# EAGLE design A4980 (EAGLE 6.5.0)
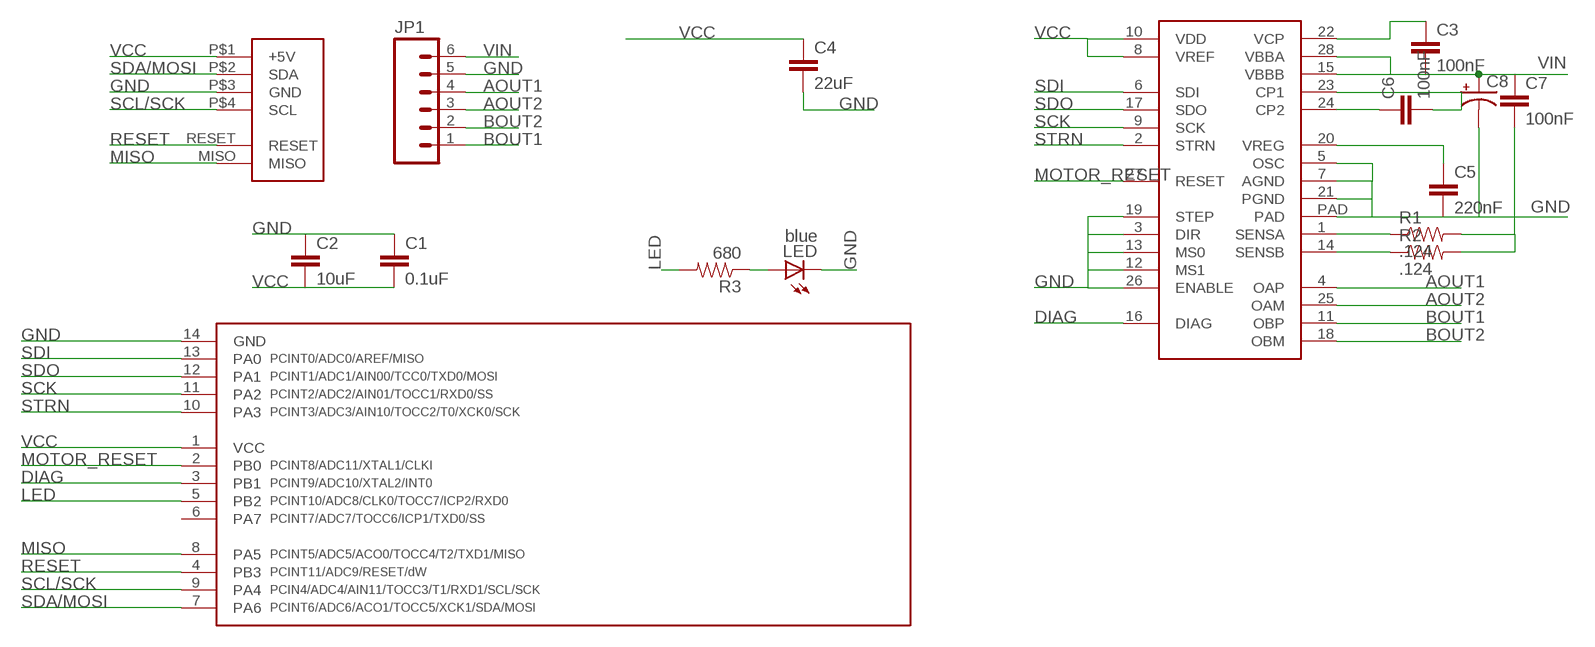
[diagram p0: schematic, sheet 1]

## Parts
C1  0.1uF  CAP0805  [0805]
C2  10uF  CAP0805  [0805]
C3  100nF  CAP0805  [0805]
C4  22uF  22UF-6.3V-20%(0805)  [0805]
C5  220nF  CAP0805  [0805]
C6  100nF  CAP0805  [0805]
C7  100nF  CAP0805  [0805]
C8  CAP_POLD  [PANASONIC_D]
JP1  M06SIP  [1X06]
LED  blue  LEDCHIPLED_1206  [CHIPLED_1206]
R1  .124  RESISTOR0805-RES  [0805]
R2  .124  RESISTOR0805-RES  [0805]
R3  680  RESISTOR0805-RES  [0805]
U$1  A4980  [TSSOP-28]
U$3  TINY841  [SOIC14]
U$4  FOOTPRINT  [FOOTPRINT]

## Nets
AOUT1: JP1.4 U$1.4(OAP)
AOUT2: JP1.3 U$1.25(OAM)
BOUT1: JP1.1 U$1.11(OBP)
BOUT2: JP1.2 U$1.18(OBM)
DIAG: U$1.16(DIAG) U$3.3(PB1)
GND: C1.1 C2.1 C4.2 C5.2 C7.2 C8.- JP1.5 LED.C R1.2 R2.2 U$1.3(DIR) U$1.5(OSC) U$1.7(AGND) U$1.12(MS1) U$1.13(MS0) U$1.19(STEP) U$1.21(PGND) U$1.26(ENABLE) U$1.PAD U$3.14(GND) U$4.P$3(GND)
LED: R3.2 U$3.5(PB2)
MISO: U$3.8(PA5) U$4.MISO
MOTOR_RESET: U$1.27(RESET) U$3.2(PB0)
N$2: C3.1 U$1.22(VCP)
N$3: R1.1 U$1.1(SENSA)
N$4: R2.1 U$1.14(SENSB)
N$5: LED.A R3.1
N$6: C5.1 U$1.20(VREG)
N$7: C6.1 U$1.24(CP2)
N$8: C6.2 U$1.23(CP1)
RESET: U$3.4(PB3) U$4.RESET
SCK: U$1.9(SCK) U$3.11(PA2)
SCL/SCK: U$3.9(PA4) U$4.P$4(SCL)
SDA/MOSI: U$3.7(PA6) U$4.P$2(SDA)
SDI: U$1.6(SDI) U$3.13(PA0)
SDO: U$1.17(SDO) U$3.12(PA1)
STRN: U$1.2(STRN) U$3.10(PA3)
VCC: C1.2 C2.2 C4.1 U$1.8(VREF) U$1.10(VDD) U$3.1(VCC) U$4.P$1(+5V)
VIN: C3.2 C7.1 C8.+ JP1.6 U$1.15(VBBB) U$1.28(VBBA)
Unconnected: U$3.6(PA7)

## Library data of the parts
C1-C3 C5-C7 = SparkFun-Capacitors:CAP: Capacitor Standard 0603 ceramic capacitor, and 0.1" leaded capacitor.
C4 = SparkFun-Capacitors:22UF-6.3V-20%(0805): CAP-08402 Ceramic; PROD_ID: CAP-08402
C8 = SparkFun-Capacitors:CAP_POL: Capacitor Polarized These are standard SMD and PTH capacitors. Normally 10uF, 47uF, and 100uF in electrolytic and tantalum varieties. Always verify the external diameter of the through hole cap, it varies with capacity, voltage, and manufacturer. The EIA devices should be standard.
JP1 = SparkFun-Connectors:M06: Header 6 Standard 6-pin 0.1" header. Use with straight break away headers (SKU : PRT-00116), right angle break away headers (PRT-00553), swiss pins (PRT-00743), machine pins (PRT-00117), and female headers (PRT-00115). Molex polarized connector foot print use with SKU : PRT-08094 with associated crimp pins and housings. NOTES ON THE VARIANTS LOCK and LOCK_LONGPADS... This footprint was designed to help hold the alignment of a through-hole component (i.e. 6-pin header) while soldering it into place. You may notice that each hole has been shifted either up or down by 0.005 of an inch from it's more standard position (which is a perfectly straight line). This slight alteration caused the pins (the squares in the middle) to touch the edges of the holes. Because they are alternating, it causes a "brace" to hold the component in place. 0.005 has proven to be the perfect amount of "off-center" position when using our standard breakaway headers. Although looks a little odd when you look at the bare footprint, once you have a header in there, the alteration is very hard to notice. Also,if you push a header all the way into place, it is covered up entirely on the bottom side. This idea of altering the position of holes to aid alignment will be further integrated into the Sparkfun Library for other footprints. It can help hold any component with 3 or more connection pins.
LED = led:LED: LED OSRAM: - CHIPLED LG R971, LG N971, LY N971, LG Q971, LY Q971, LO R971, LY R971 LH N974, LH R974 LS Q976, LO Q976, LY Q976 LO Q996 - Hyper CHIPLED LW Q18S LB Q993, LB Q99A, LB R99A - SideLED LS A670, LO A670, LY A670, LG A670, LP A670 LB A673, LV A673, LT A673, LW A673 LH A674 LY A675 LS A676, LA A676, LO A676, LY A676, LW A676 LS A679, LY A679, LG A679 - Hyper Micro SIDELED® LS Y876, LA Y876, LO Y876, LY Y876 LT Y87S - SmartLED LW L88C, LW L88S LB L89C, LB L89S, LG L890 LS L89K, LO L89K, LY L89K LS L896, LA L896, LO L896, LY L896 - TOPLED LS T670, LO T670, LY T670, LG T670, LP T670 LSG T670, LSP T670, LSY T670, LOP T670, LYG T670 LG T671, LOG T671, LSG T671 LB T673, LV T673, LT T673, LW T673 LH T674 LS T676, LA T676, LO T676, LY T676, LB T676, LH T676, LSB T676, LW T676 LB T67C, LV T67C, LT T67C, LS T67K, LO T67K, LY T67K, LW E67C LS E67B, LA E67B, LO E67B, LY E67B, LB E67C, LV E67C, LT E67C LW T67C LS T679, LY T679, LG T679 LS T770, LO T770, LY T770, LG T770, LP T770 LB T773, LV T773, LT T773, LW T773 LH T774 LS E675, LA E675, LY E675, LS T675 LS T776, LA T776, LO T776, LY T776, LB T776 LHGB T686 LT T68C, LB T68C - Hyper Mini TOPLED® LB M676 - Mini TOPLED Santana® LG M470 LS M47K, LO M47K, LY M47K Source: http://www.osram.convergy.de LUXEON: - LUMILED® LXK2-PW12-R00, LXK2-PW12-S00, LXK2-PW14-U00, LXK2-PW14-V00 LXK2-PM12-R00, LXK2-PM12-S00, LXK2-PM14-U00 LXK2-PE12-Q00, LXK2-PE12-R00, LXK2-PE12-S00, LXK2-PE14-T00, LXK2-PE14-U00 LXK2-PB12-K00, LXK2-PB12-L00, LXK2-PB12-M00, LXK2-PB14-N00, LXK2-PB14-P00, LXK2-PB14-Q00 LXK2-PR12-L00, LXK2-PR12-M00, LXK2-PR14-Q00, LXK2-PR14-R00 LXK2-PD12-Q00, LXK2-PD12-R00, LXK2-PD12-S00 LXK2-PH12-R00, LXK2-PH12-S00 LXK2-PL12-P00, LXK2-PL12-Q00, LXK2-PL12-R00 Source: www.luxeon.com KINGBRIGHT: KA-3528ASYC Source: www.kingbright.com
R1 R2 = SparkFun-Resistors:RESISTOR: Resistor Basic schematic elements and footprints for 0603, 1206, and PTH resistors.
R3 = SparkFun-Passives:RESISTOR: Resistor Basic schematic elements and footprints for 0603, 1206, and PTH resistors.
U$1 = IntegerLabs:A4980
U$3 = IntegerLabs:TINY841
U$4 = IntegerLabs:FOOTPRINT

## Board
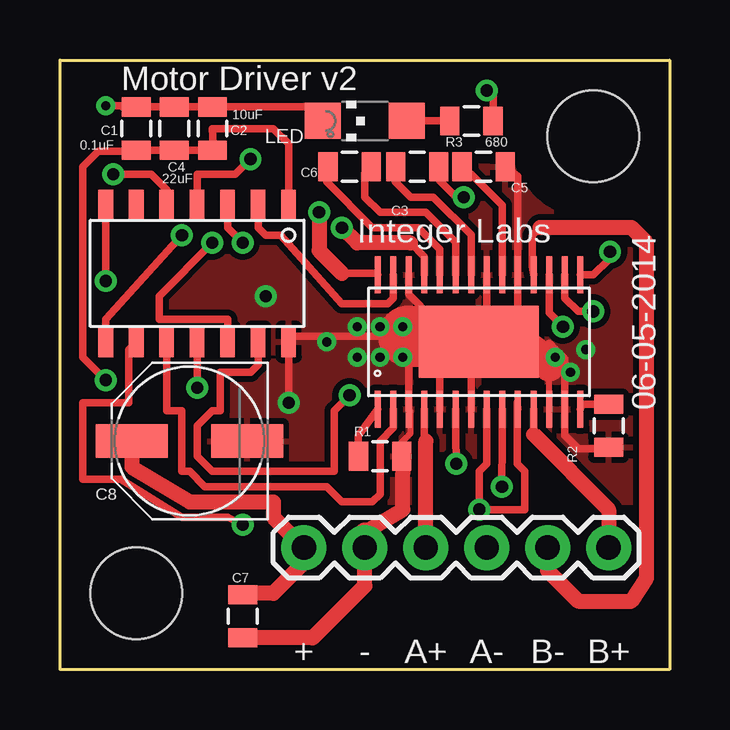
[diagram p1: board, top side]
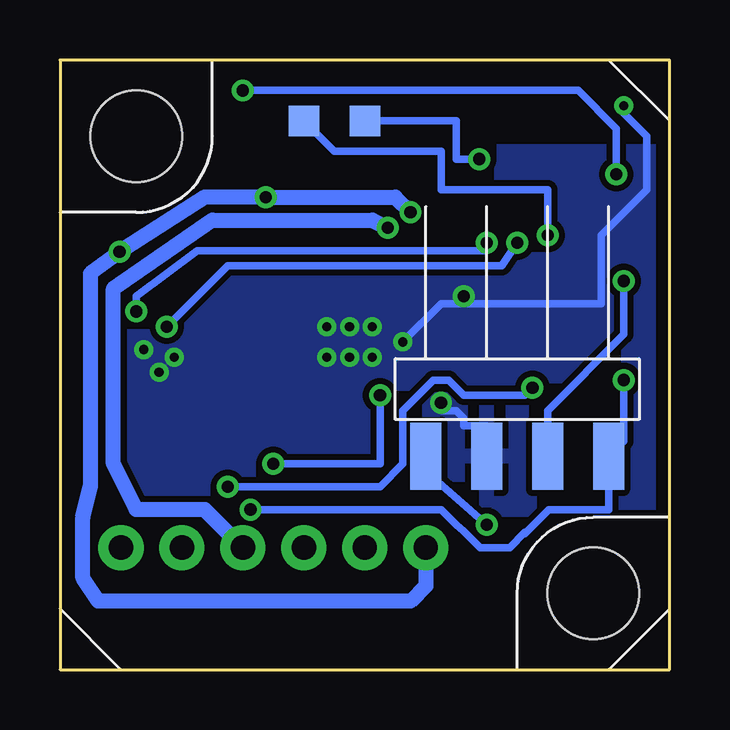
[diagram p2: board, bottom side, seen from below]

Size 25.4 x 25.4 mm. Coordinates in mm from the lower left corner, seen from the top.
Copper layers (1*16): Top 0.0178mm / dielectric 59mil / Bottom 0.0178mm
Design rules "SSC-EAGLE-2Lyr_v1.0.0.3": minimum track width 6mil, minimum drill 14mil, track to track 6mil, track to pad 6mil, pad to pad 6mil, via to via 6mil, smd to smd 6mil, copper to edge 20mil, drill to drill 16mil, minimum pad ring 8mil, minimum via ring 8mil, stop-mask expansion 3mil, vias tented up to drill 0mil, thermal gap 10mil

### Footprints (pad centres in the part's own frame; a part is rotated, then mirrored left to right if it is on the bottom)
0805 = smd 0.8 x 1.2: 1 -0.9,0; 2 0.9,0
PANASONIC_D = smd 3 x 1.4: + 2.4,0; - -2.4,0
1X06 = drill 1.016 pad 1.88: 1 0,0; 2 2.54,0; 3 5.08,0; 4 7.62,0; 5 10.16,0; 6 12.7,0
CHIPLED_1206 = smd 1.5 x 1.5: A 0,-1.75; C 0,1.75
TSSOP-28 = smd 0.25 x 1.55: 1 -4.55,-2.8; 2 -3.9,-2.8; 3 -3.25,-2.8; 4 -2.6,-2.8; 5 -1.95,-2.8; 6 -1.3,-2.8; 7 -0.65,-2.8; 8 0,-2.8; 9 0.65,-2.8; 10 1.3,-2.8; 11 1.95,-2.8; 12 2.6,-2.8; 13 3.25,-2.8; 14 3.9,-2.8; 15 3.9,2.8; 16 3.25,2.8; 17 2.6,2.8; 18 1.95,2.8; 19 1.3,2.8; 20 0.65,2.8; 21 0,2.8; 22 -0.65,2.8; 23 -1.3,2.8; 24 -1.95,2.8; 25 -2.6,2.8; 26 -3.25,2.8; 27 -3.9,2.8; 28 -4.55,2.8 | smd 5 x 3: PAD -0.325,0
SOIC14 = smd 0.61 x 1.27: 1 0,-3.175; 2 1.27,-3.175; 3 2.54,-3.175; 4 3.81,-3.175; 5 5.08,-3.175; 6 6.35,-3.175; 7 7.62,-3.175; 8 7.62,2.54; 9 6.35,2.54; 10 5.08,2.54; 11 3.81,2.54; 12 2.54,2.54; 13 1.27,2.54; 14 0,2.54
FOOTPRINT = smd 1.27 x 1.27 bottom: MISO 15.24,22.86; RESET 12.7,22.86 | smd 1.295 x 2.794 bottom: P$1 2.54,8.89; P$2 5.08,8.89; P$3 7.62,8.89; P$4 10.16,8.89 | hole 3.81: 22.225,22.225; 3.175,3.175

### Placement (x,y rotation side)
C1  3.17,22.54 270 top
C2  6.35,22.54 270 top
C3  14.88,20.95 0 top
C4  4.76,22.54 90 top
C5  17.65,20.95 0 top
C6  12.06,20.95 0 top
C7  7.62,2.22 270 top
C8  5.4,9.53 180 top
JP1  22.86,5.08 180 top
LED  12.7,22.86 90 top
R1  13.34,8.89 0 top
R2  22.86,10.16 270 top
R3  17.14,22.86 0 top
U$1  17.78,13.65 0 top
U$3  9.53,16.19 180 top
U$4  0,0 0 top

### Tracks (layer width: path | path; a pad name or v marks a point on that pad's centre or on a via)
AOUT1
  Top 0.305: 15.24,9.53 15.18,9.59 U$1.4
  Top 0.635: JP1.4 15.24,9.53
AOUT2  (via drill 0.51)
  Top 0.305: U$1.25 15.18,17.2 14.61,17.78
  Top 0.635: 14.61,17.78 12.38,17.78 v11.75,18.41
  Bottom 0.635: JP1.3 19.37,6.67 22.23,6.67 23.18,8.57 23.18,15.88 19.05,18.73 12.38,18.73 v11.75,18.41
BOUT1
  Top 0.305: U$1.11 19.73,9.8
  Top 0.635: 19.73,9.8 22.86,6.67 JP1.1
BOUT2
  Top 0.305: 20,18.41 19.68,18.1 19.68,16.82 U$1.18
  Top 0.635: JP1.2 20.32,4.13 21.59,2.86 23.81,2.86 24.45,3.81 24.45,17.78 23.81,18.41 20,18.41
DIAG  (via drill 0.51)
  Top 0.305: U$1.16 21.03,15.48 21.59,14.92 v22.23,14.92 | U$3.3 6.99,18.41 v7.62,17.78
  Bottom 0.305: v7.62,17.78 7.62,17.46 19.68,17.46 22.23,15.56 v22.23,14.92
GND  (via drill 0.38, 0.51)
  Top 0.254: U$1.12 20.38,12.64 | 19.68,13.34 20.12,13.34 20.38,13.59 | R1.2 14.23,9.47 14.61,9.84 14.61,10.78 U$1.3
  Top 0.305: U$1.3 14.53,13.89 9.6,13.89 U$3.14 v9.53,11.11 | 16.19,13.97 16.51,13.97 16.51,13.34 15.83,12.65 U$1.5 | 15.48,13.41 15.56,13.97 | 20.38,13.59 21.03,12.94 U$1.13 21.03,9.77 21.59,9.21 23.12,9.21 | LED.C 10.37,23.44 C2.1 C4.2 C1.1 2.59,23.44 2.54,23.5 | C5.2 19.08,20.55 U$1.19 19.08,14.32 | v1.91,23.5 2.54,23.5 | 2.54,23.5 3.17,23.5 | U$1.26 14.53,15.63 15.56,14.61 15.56,13.97 | U$1.21 17.78,13.98 U$1.PAD 17.13,13.33 U$1.7 | 15.48,13.89 15.56,13.97
  Top 0.406: 14.29,8.2 R1.2 | 23.12,9.21 R2.2
  Top 0.635: 16.19,13.97 15.56,13.97 | 18.73,13.97 19.08,14.32 18.79,13.97 18.41,13.65 | 12.7,5.71 14.29,6.67 14.29,8.2 | JP1.5 12.7,3.49 10.53,1.32 C7.2
  Top 0.813: JP1.5 12.7,5.71
  Top 1.27: 20.38,12.64 19.68,13.34
  Top 2.54: 14.53,13.89 15.48,13.89
  Bottom 0.305: U$4.P$3 7.62,10.16 8.57,10.16 8.57,10.48 8.89,10.79 9.53,10.79 v9.53,11.11 | v1.91,23.5 1.91,23.18 0.95,22.23 0.95,20 2.86,18.1 2.86,15.24 9.53,15.24 v11.11,13.65
  other vias: 12.38,14.29 21.91,13.34 14.29,14.29 14.29,13.02 13.34,13.02 12.38,13.02 13.34,14.29 21.27,12.38 20.64,13.02 8.57,15.56
  pour Top (isolate 0.254): 0.32,6.99 25.72,6.99 25.72,20.95 0.32,20.95
  pour Bottom (isolate 0.254): 0,6.67 25.4,6.67 25.4,21.59 0,21.59
LED  (via drill 0.51)
  Top 0.305: U$3.5 4.45,20 3.81,20.64 v2.22,20.64 | R3.2 18.05,23.86 v17.78,24.13
  Bottom 0.305: v17.78,24.13 3.81,24.13 2.22,22.54 v2.22,20.64
MISO  (via drill 0.51)
  Top 0.305: U$3.8 1.91,14.61 v5.08,18.1
  Bottom 0.305: U$4.MISO 13.97,21.59 9.53,21.59 9.53,20 5.08,20 v5.08,18.1
MOTOR_RESET
  Top 0.305: U$1.27 13.88,15.47 13.65,15.24 11.75,15.24 9.21,18.1 8.57,18.1 8.26,18.41 U$3.2
N$2
  Top 0.305: U$1.22 17.13,18.11 15.56,19.68 14.61,19.68 13.97,20.32 13.97,20.9 C3.1
N$3
  Top 0.305: R1.1 12.44,9.74 U$1.1
N$4
  Top 0.305: R2.1 21.79,11.06 U$1.14
N$5
  Top 0.305: LED.A R3.1
N$6
  Top 0.305: U$1.20 18.43,19.35 17.14,20.64 16.88,20.64 C5.1
N$7
  Top 0.305: U$1.24 15.83,17.51 14.92,18.41 13.02,18.41 11.11,20.32 11.11,20.9 C6.1
N$8
  Top 0.305: U$1.23 16.48,17.81 15.24,19.05 13.34,19.05 12.7,19.68 12.7,20.69 C6.2
RESET  (via drill 0.51)
  Top 0.305: U$3.4 5.71,20.64 7.3,20.64 v7.94,21.27
  Bottom 0.305: U$4.RESET 8.89,22.86 8.89,21.27 v7.94,21.27
SCK  (via drill 0.51)
  Top 0.305: U$1.9 18.43,9.54 v18.41,7.62 | U$3.11 v5.71,11.75
  Bottom 0.305: v5.71,11.75 6.03,11.43 8.57,11.43 9.21,12.06 9.84,12.06 11.11,10.79 11.11,8.57 12.06,7.62 v18.41,7.62
SCL/SCK  (via drill 0.51)
  Top 0.305: U$3.9 2.86,13.34 2.86,11.11 0.95,11.11 0.95,7.94 2.54,7.94 5.08,6.35 6.99,6.35 v7.62,6.03
  Bottom 0.305: U$4.P$4 10.16,8.26 v7.62,6.03
SDA/MOSI  (via drill 0.51)
  Top 0.305: U$3.7 v1.91,16.19
  Bottom 0.305: U$4.P$2 5.08,10.79 1.91,13.97 v1.91,16.19
SDI  (via drill 0.51)
  Top 0.305: U$1.6 16.48,9.81 v16.51,8.57 | U$3.13 8.26,12.7 7.94,12.38 6.67,12.38 6.67,10.79 6.35,10.79 5.71,10.16 5.71,8.89 6.35,8.26 11.43,8.26 11.43,10.79 v12.06,11.43
  Bottom 0.305: v12.06,11.43 12.06,8.57 v16.51,8.57
SDO  (via drill 0.51)
  Top 0.305: U$1.17 20.38,14.86 v20.95,14.29 | U$3.12 6.99,14.61 4.13,14.61 4.13,15.56 v6.35,17.78
  Bottom 0.305: v6.35,17.78 6.99,16.83 18.41,16.83 v20.95,14.29
STRN
  Top 0.305: U$1.2 13.88,10.07 13.34,9.53 13.34,7.3 13.02,6.99 11.75,6.99 11.11,7.62 6.03,7.62 5.4,8.26 5.08,8.26 5.08,10.79 4.45,10.79 U$3.10
VCC  (via drill 0.51)
  Top 0.305: U$1.8 17.78,8.57 17.46,8.26 v17.46,6.67 19.37,6.67 19.37,8.26 19.05,8.57 19.05,11.14 U$1.10 | v1.91,12.06 0.95,13.02 0.95,20.95 1.59,21.59 3.12,21.59 C1.2 C4.1 C2.2 6.4,21.59 6.35,22.54 8.89,22.54 9.53,21.91 U$3.1
  Bottom 0.305: v17.46,6.67 9.53,6.67 8.89,6.03 8.57,5.76 7.89,5.08 6.67,5.08 6.03,5.71 6.03,5.67 5.03,6.67 2.54,6.67 U$4.P$1 1.91,9.53 v1.91,12.06
VIN  (via drill 0.51)
  Top 0.305: U$1.15 22.23,16.45 22.86,17.09 22.86,17.14 v22.92,17.41 | 11.75,16.51 13.17,16.51 U$1.28 | C3.2 15.82,20.37 16.51,19.68 v16.83,19.68
  Top 0.406: 7.67,3.17 C7.1
  Top 0.635: 7.67,3.17 8.89,3.17 10.16,4.45 JP1.6 8.89,6.35 8.89,6.99 5.4,6.99 3,8.43 C8.+ | v10.79,19.05 10.79,17.46 11.75,16.51
  Bottom 0.635: JP1.6 10.16,3.49 10.79,2.86 23.81,2.86 24.45,3.81 24.45,6.35 24.13,7.62 24.13,16.51 v22.92,17.41 19.37,19.68 v16.83,19.68 11.43,19.68 v10.79,19.05

### Text on the board
tPlace: Motor Driver v2 | Integer Labs | 06-05-2014 | + | - | A+ | A- | B- | B+